# Altium project Wacky_Init.PrjPcb
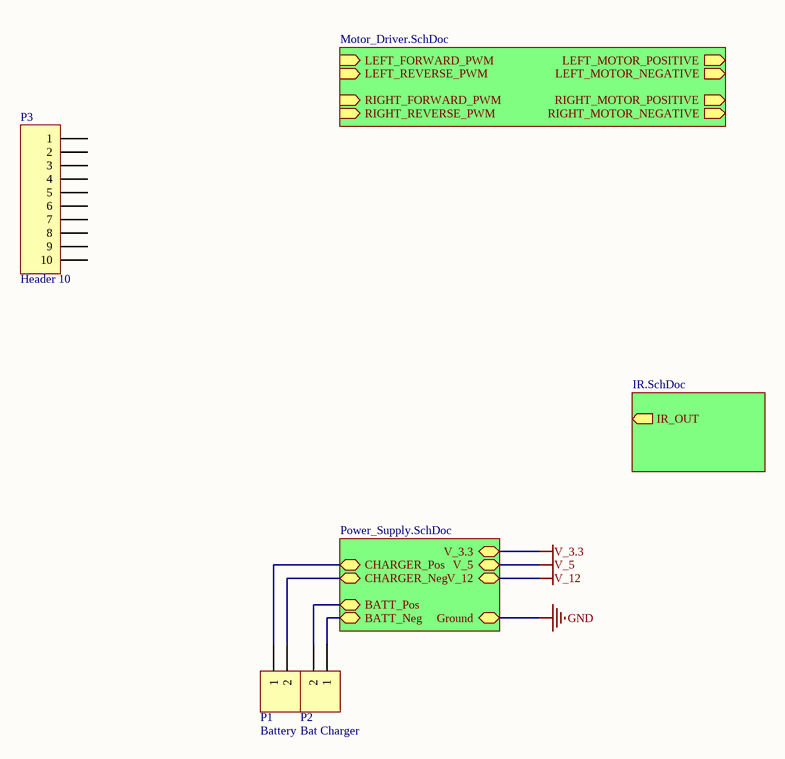
[diagram p0: Motor_Board.SchDoc]
6 sheets, 21 parts. Net scope: hierarchical (ports join the sheet entries above them; power ports are global).
Sheets:
  Motor_Board.SchDoc
     = Motor_Driver.SchDoc
     = IR.SchDoc
  Camera_Board.SchDoc
     = Bluetooth.SchDoc
     = Camera.SchDoc

## Sheet Motor_Board.SchDoc
size A4; DrawnBy: Mike Cusdin; Organization: University of Canterbury; Address1: Electrical & Computer Eng; Address2: Private Bag 4800; Address3: Christchurch 8020; Address4: New Zealand; Revision: 2.0

### Parts
P1  Battery  [TMHDR2]
P2  Bat Charger  [DC1.6]
P3  Header 10  [HDR1X10]

### Sub-sheets
? = Power_Supply.SchDoc (file not in this document): BATT_Pos, CHARGER_Neg, CHARGER_Pos, BATT_Neg, V_5, Ground, V_3.3, V_12
? = Motor_Driver.SchDoc: LEFT_FORWARD_PWM (in), RIGHT_FORWARD_PWM (in), LEFT_MOTOR_POSITIVE (out), RIGHT_MOTOR_POSITIVE (out), RIGHT_REVERSE_PWM (in), LEFT_REVERSE_PWM (in), RIGHT_MOTOR_NEGATIVE (out), LEFT_MOTOR_NEGATIVE (out)
? = IR.SchDoc: IR_OUT (out)

### Nets
V_5: sheet /V_5
NetP1_1: P1.1 ; sheet /CHARGER_Pos
NetP1_2: P1.2 ; sheet /CHARGER_Neg
NetP2_1: P2.1 ; sheet /BATT_Neg
NetP2_2: P2.2 ; sheet /BATT_Pos

Not connected (* = marked no-connect by the designer): P3 1 2 3 4 5 6 7 8 9 10

### Notes on the sheet
- Title
- Size:
- Date:
- A4
- Number:
- Time:
- Revision:
- Sheet
- of
- File:

### Library data of the parts
P1 = MHDR1X2: Header, 2-Pin; LatestRevisionDate: 17-Jul-2002; LatestRevisionNote: Re-released for DXP Platform.; Publisher: Altium Limited
P2 = Header 2: Header, 2-Pin; LatestRevisionDate: 17-Jul-2002; LatestRevisionNote: Re-released for DXP Platform.; Publisher: Altium Limited
P3 = Header 10: Header, 10-Pin; LatestRevisionDate: 17-Jul-2002; LatestRevisionNote: Re-released for DXP Platform.; Publisher: Altium Limited

## Sheet Motor_Driver.SchDoc
size A4; Organization: Altium Limited; Address1: 3 Minna Close; Address2: Belrose; Address3: NSW 2085; Address4: Australia
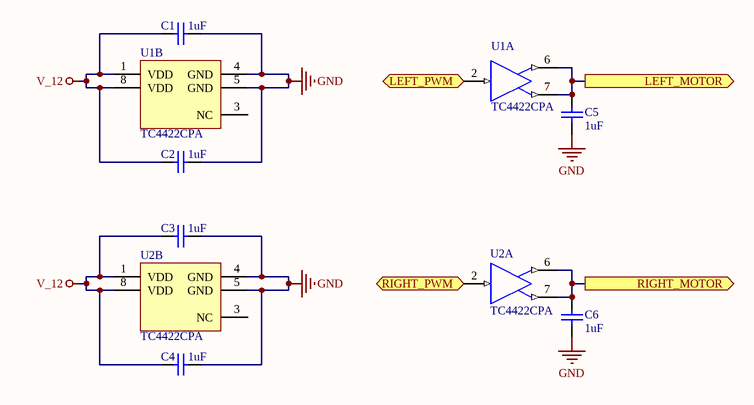
[diagram p1: Motor_Driver.SchDoc]

### Parts
C1  value 1uF  [RAD-0.3]  (hidden comment: Cap)
C2  value 1uF  [RAD-0.3]  (hidden comment: Cap)
C3  value 1uF  [RAD-0.3]  (hidden comment: Cap)
C4  value 1uF  [RAD-0.3]  (hidden comment: Cap)
C5  value 1uF  [RAD-0.3]  (hidden comment: Cap)
C6  value 1uF  [RAD-0.3]  (hidden comment: Cap)
U1  TC4422CPA  [PDIP300-PA8]  (parts A,B of 2)
U2  TC4422CPA  [PDIP300-PA8]  (parts A,B of 2)

### Ports
LEFT_MOTOR (out), LEFT_PWM (in), RIGHT_MOTOR (out), RIGHT_PWM (in)

### Nets
GND: C1.2 C2.2 C3.2 C4.2 C5.1 C6.1 U1.4(GND) U1.5(GND) U2.4(GND) U2.5(GND)
V_12: C1.1 C2.1 C3.1 C4.1 U1.1(VDD) U1.8(VDD) U2.1(VDD) U2.8(VDD)
NetC5_2: C5.2 U1.6(OUT) U1.7(OUT) ; port LEFT_MOTOR
NetC6_2: C6.2 U2.6(OUT) U2.7(OUT) ; port RIGHT_MOTOR
NetU1_2: U1.2(IN) ; port LEFT_PWM
NetU2_2: U2.2(IN) ; port RIGHT_PWM

Not connected (* = marked no-connect by the designer): U1 3(NC); U2 3(NC)

### Notes on the sheet
- Title
- Size:
- Date:
- A4
- Number:
- Time:
- Revision:
- Sheet
- of
- File:

### Library data of the parts
C1-C6 = Cap: Capacitor; Published: 8-Jun-2000; LatestRevisionDate: 17-Jul-2002; LatestRevisionNote: Re-released for DXP Platform.; PackageReference: RAD-0.3; Publisher: Altium Limited
U1 U2 = TC4422CPA: 9A High-Speed MOSFET Driver, Non-Inverting, Commercial Temperature; FirstPublished: 29-Jan-2009; DatasheetVersion: revD, Sep-2004; PackageVersion: revBB, Aug-2009; PackageReference: PDIP300-PA8; Publisher: Altium Limited; PackageDescription: 8-Lead Plastic Dual In-Line (PA) - 300 mil Body [PDIP]; Supplier 1: Digi-Key; Supplier Part Number 1: TC4422CPA-ND; Supplier 2: Farnell; Supplier Part Number 2: 1196785; Supplier 3: Farnell; Supplier Part Number 3: 1523810; Code_JEDEC: MS-001-BA; ComponentLink1Description: Datasheet; ComponentLink1URL: http://ww1.microchip.com/downloads/en/DeviceDoc/21420d.pdf; ComponentLink2Description: Packaging Specification; ComponentLink2URL: http://www.microchip.com/stellent/groups/techpub_sg/documents/packagingspec/en012702.pdf; ComponentLink3Description: Microchip.com Home; ComponentLink3URL: http://www.microchip.com/; Supplier 4: Newark; Supplier Part Number 4: 88K1245

## Sheet IR.SchDoc
size A4
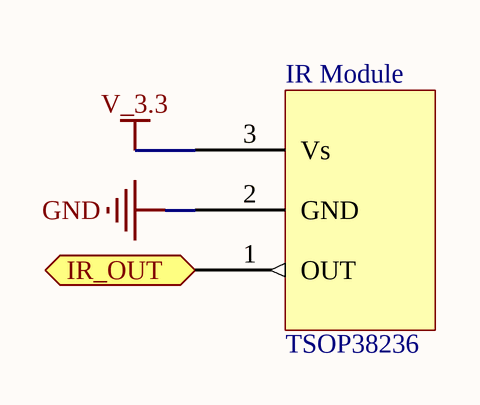
[diagram p2: IR.SchDoc]

### Parts
IR_Module  TSOP38236  [TSOP38236 IR Receiver]

### Ports
IR_OUT (out)

### Nets
GND: IR_Module.2(GND)
V_3.3: IR_Module.3(Vs)
NetIR_Module_1: IR_Module.1(OUT) ; port IR_OUT

## Sheet Camera_Board.SchDoc
size A4
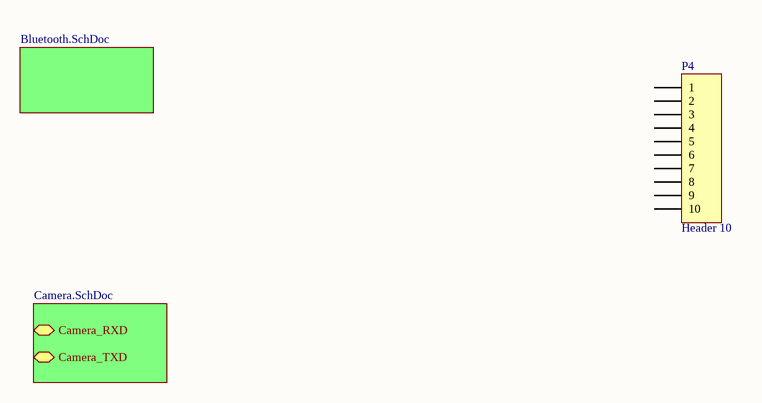
[diagram p3: Camera_Board.SchDoc]

### Parts
P4  Header 10  [HDR1X10]

### Sub-sheets
? = Bluetooth.SchDoc: no entries
? = Camera.SchDoc: Camera_RXD, Camera_TXD

### Nets

Not connected (* = marked no-connect by the designer): P4 1 2 3 4 5 6 7 8 9 10

### Library data of the parts
P4 = Header 10: Header, 10-Pin; LatestRevisionDate: 17-Jul-2002; LatestRevisionNote: Re-released for DXP Platform.; Publisher: Altium Limited

## Sheet Bluetooth.SchDoc
size A4
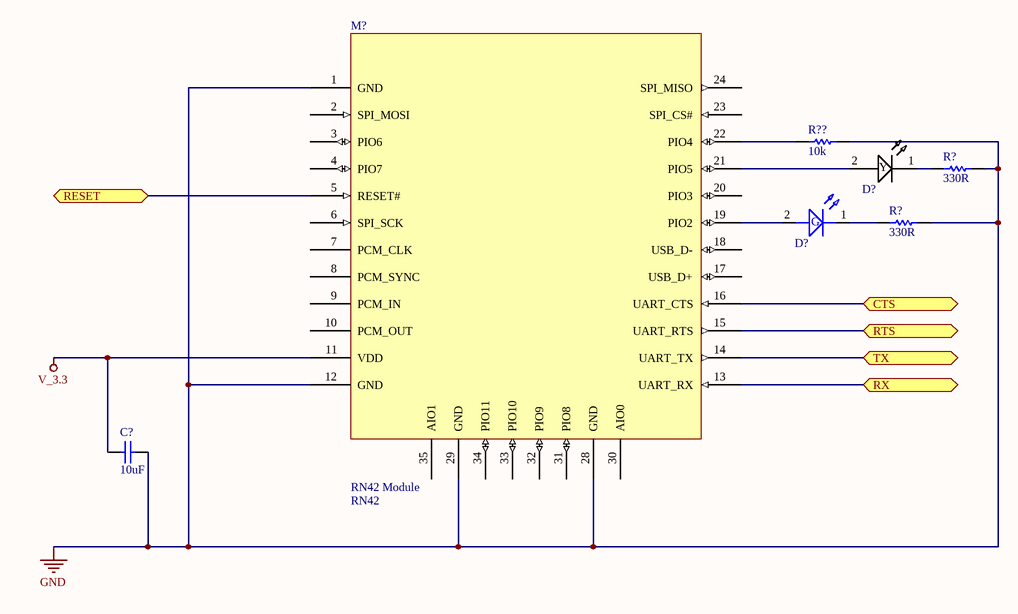
[diagram p4: Bluetooth.SchDoc]

### Parts
(Parts that share a designator on the sheet are numbered #1, #2 ... from top to bottom, then left to right.)
C?  10uF  [0805]
D?#1  DL_Dialight_YELLOW_rightangle  [G_Dialight_One-level_3mm]  (value not drawn)
D?#2  DL_Dialight_GREEN_rightangle  [G_Dialight_One-level_3mm]  (value not drawn)
M?  RN42 Module  value RN42  [RN42-LAND]  (no BOM)
R?#1  330R  [0603]
R?#2  330R  [0603]
R??  10k  [0603]

### Ports
CTS, RESET, RTS, RX, TX

### Nets
GND: C?.2 M?.1(GND) M?.12(GND) M?.28(GND) M?.29(GND) R?#1.2 R?#2.2 R??.2
V_3.3: C?.1 M?.11(VDD)
NetD?#1_1: D?#1.1(C) R?#1.1
NetD?#1_2: D?#1.2(A) M?.21(PIO5)
NetD?#2_1: D?#2.1(C) R?#2.1
NetD?#2_2: D?#2.2(A) M?.19(PIO2)
NetM?_5: M?.5(RESET#) ; port RESET
NetM?_13: M?.13(UART_RX) ; port RX
NetM?_14: M?.14(UART_TX) ; port TX
NetM?_15: M?.15(UART_RTS) ; port RTS
NetM?_16: M?.16(UART_CTS) ; port CTS
NetM?_22: M?.22(PIO4) R??.1

Not connected (* = marked no-connect by the designer): M? 2(SPI_MOSI) 3(PIO6) 4(PIO7) 6(SPI_SCK) 7(PCM_CLK) 8(PCM_SYNC) 9(PCM_IN) 10(PCM_OUT) 17(USB_D+) 18(USB_D-) 20(PIO3) 23(SPI_CS#) 24(SPI_MISO) 30(AIO0) 31(PIO8) 32(PIO9) 33(PIO10) 34(PIO11) 35(AIO1)

### Notes on the sheet
- (in symbol DL_Dialight_GREEN_rightangle) G
- (in symbol DL_Dialight_YELLOW_rightangle) Y

### Library data of the parts
C? = CP_10uF 0805: CAP 10uF 10% 10V X5R 0805; Manufacturer: Murata; Manufacturer PN: GRM219R61A106KE44D; LatestRevisionDate: 29 May 08; Supplier_Component_Code: 490-4735-1-ND; Supplier_Name: Digikey; Supplier 1: Digi-Key; Supplier Part Number 1: 490-4735-1-ND; Value: 10uF
D?#1 = DL_Dialight_YELLOW_rightangle: LED 3MM RT ANG HI EFF YEL PC MNT; Manufacturer PN: 551-0309F; Manufacturer: Dialight; Supplier_Component_Code: 350-1667-ND; Supplier_Name: Digikey; Supplier 1: Digi-Key; Supplier Part Number 1: 350-1667-ND
D?#2 = DL_Dialight_GREEN_rightangle: LED 3MM RT ANG HI EFF GRN PC MNT; Manufacturer PN: 551-0209; Manufacturer: Dialight; Supplier_Component_Code: 350-1665-ND; Supplier_Name: Digikey; Supplier 1: Digi-Key; Supplier Part Number 1: 350-1665-ND
M? = RN42MOD
R?#1 R?#2 = RS_330R 0603: RES 330 OHM 1/10W 1% 0603 SMD; Manufacturer: Yageo; Manufacturer PN: RC0603FR-07330RL; LatestRevisionDate: 25 June 2009; Supplier_Name: Digikey; Supplier 1: Digi-Key; Supplier Part Number 1: 311-330HRTR-ND; Value: 330R
R?? = RS_10k 0603: RES 10.0K OHM 1/10W 1% 0603 SMD; Manufacturer: Yageo; Manufacturer PN: RC0603FR-0710KL; LatestRevisionDate: 29 May 08; Supplier_Name: Digikey; Supplier 1: Digi-Key; Supplier Part Number 1: 311-10.0KHRTR-ND; Value: 10k

## Sheet Camera.SchDoc
size A4
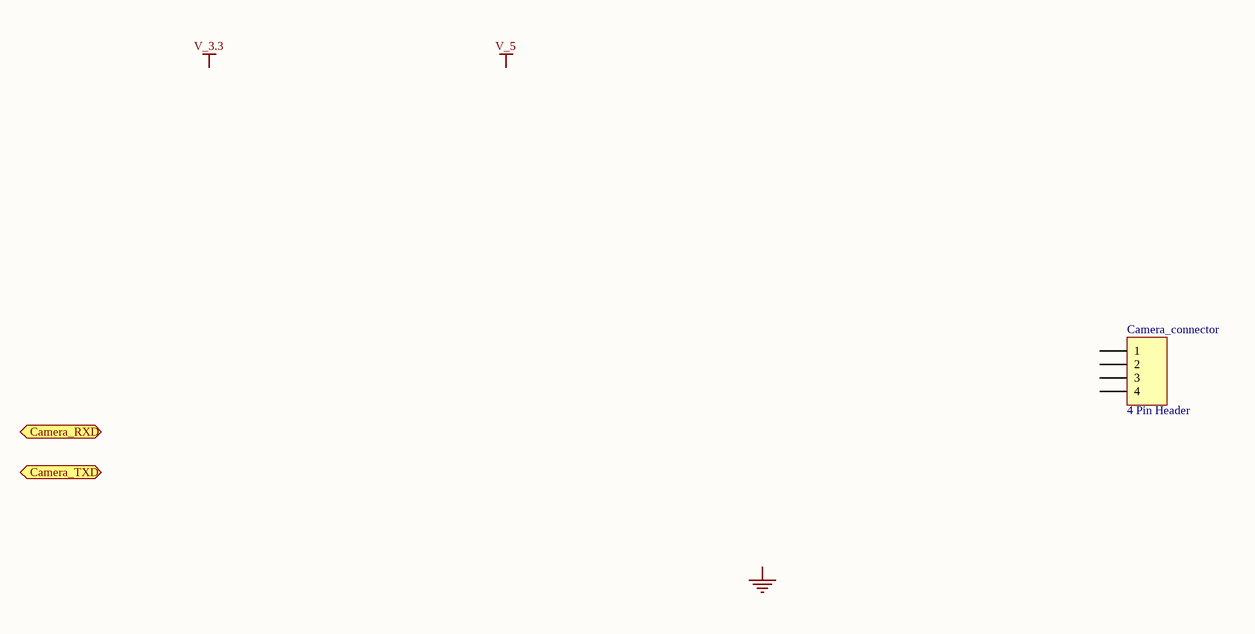
[diagram p5: Camera.SchDoc]

### Parts
Camera_connector  4 Pin Header  [CONN_4X1_SMT_RA_1.25MM]

### Ports
Camera_RXD, Camera_TXD

### Nets

Not connected (* = marked no-connect by the designer): Camera_connector 1 2 3 4

### Notes on the sheet
- Labels drawn without touching a wire or pin: GND, V_3.3, V_5

### Library data of the parts
Camera_connector = JP_4PIN HDR_SMT_RA_MOLEX_1: CONN HDR VERT 4POS .100" SNGL; Manufacturer: Molex; Manufacturer PN: 53261-0471; Verify: Not Checked; LatestRevisionDate: 24 Jun 08; Supplier_Component_Code: WM7622CT-ND; Supplier_Name: Digikey; Supplier 1: Digi-Key; Supplier Part Number 1: WM7622CT-ND; Value: 4 Pin Header

## Nets that join several sheets
GND: Motor_Driver (10 pins), IR (IR_Module.2), Bluetooth (8 pins)
V_3.3: IR (IR_Module.3), Bluetooth (C?.1 M?.11)